# EAGLE design SNES-logo-leds (EAGLE 7.2.0)
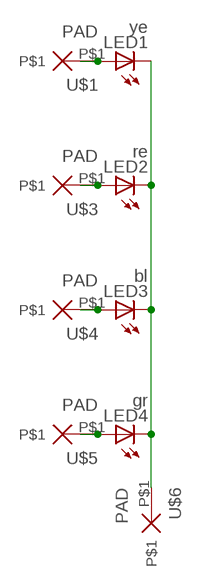
[diagram p0: schematic, sheet 1]

## Parts
LED1  ye  LEDSML0805  [SML0805]
LED2  re  LEDSML0805  [SML0805]
LED3  bl  LEDSML0805  [SML0805]
LED4  gr  LEDSML0805  [SML0805]
U$1  PAD  [PAD]
U$3  PAD  [PAD]
U$4  PAD  [PAD]
U$5  PAD  [PAD]
U$6  PAD  [PAD]

## Nets
N$1: LED1.C LED2.C LED3.C LED4.C U$6.P$1
N$3: LED1.A U$1.P$1
N$20: LED2.A U$3.P$1
N$21: LED3.A U$4.P$1
N$22: LED4.A U$5.P$1

## Library data of the parts
LED1-LED4 = led:LED: LED OSRAM: - CHIPLED LG R971, LG N971, LY N971, LG Q971, LY Q971, LO R971, LY R971 LH N974, LH R974 LS Q976, LO Q976, LY Q976 LO Q996 - Hyper CHIPLED LW Q18S LB Q993, LB Q99A, LB R99A - SideLED LS A670, LO A670, LY A670, LG A670, LP A670 LB A673, LV A673, LT A673, LW A673 LH A674 LY A675 LS A676, LA A676, LO A676, LY A676, LW A676 LS A679, LY A679, LG A679 - Hyper Micro SIDELED® LS Y876, LA Y876, LO Y876, LY Y876 LT Y87S - SmartLED LW L88C, LW L88S LB L89C, LB L89S, LG L890 LS L89K, LO L89K, LY L89K LS L896, LA L896, LO L896, LY L896 - TOPLED LS T670, LO T670, LY T670, LG T670, LP T670 LSG T670, LSP T670, LSY T670, LOP T670, LYG T670 LG T671, LOG T671, LSG T671 LB T673, LV T673, LT T673, LW T673 LH T674 LS T676, LA T676, LO T676, LY T676, LB T676, LH T676, LSB T676, LW T676 LB T67C, LV T67C, LT T67C, LS T67K, LO T67K, LY T67K, LW E67C LS E67B, LA E67B, LO E67B, LY E67B, LB E67C, LV E67C, LT E67C LW T67C LS T679, LY T679, LG T679 LS T770, LO T770, LY T770, LG T770, LP T770 LB T773, LV T773, LT T773, LW T773 LH T774 LS E675, LA E675, LY E675, LS T675 LS T776, LA T776, LO T776, LY T776, LB T776 LHGB T686 LT T68C, LB T68C - Hyper Mini TOPLED® LB M676 - Mini TOPLED Santana® LG M470 LS M47K, LO M47K, LY M47K Source: http://www.osram.convergy.de LUXEON: - LUMILED® LXK2-PW12-R00, LXK2-PW12-S00, LXK2-PW14-U00, LXK2-PW14-V00 LXK2-PM12-R00, LXK2-PM12-S00, LXK2-PM14-U00 LXK2-PE12-Q00, LXK2-PE12-R00, LXK2-PE12-S00, LXK2-PE14-T00, LXK2-PE14-U00 LXK2-PB12-K00, LXK2-PB12-L00, LXK2-PB12-M00, LXK2-PB14-N00, LXK2-PB14-P00, LXK2-PB14-Q00 LXK2-PR12-L00, LXK2-PR12-M00, LXK2-PR14-Q00, LXK2-PR14-R00 LXK2-PD12-Q00, LXK2-PD12-R00, LXK2-PD12-S00 LXK2-PH12-R00, LXK2-PH12-S00 LXK2-PL12-P00, LXK2-PL12-Q00, LXK2-PL12-R00 Source: www.luxeon.com KINGBRIGHT: KA-3528ASYC Source: www.kingbright.com
U$1 U$3-U$6 = MS_Mod:PAD

## Board
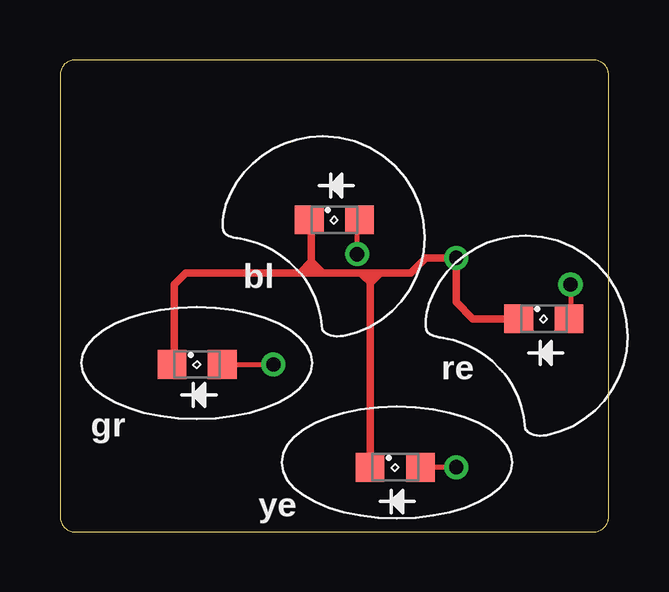
[diagram p1: board, top side]
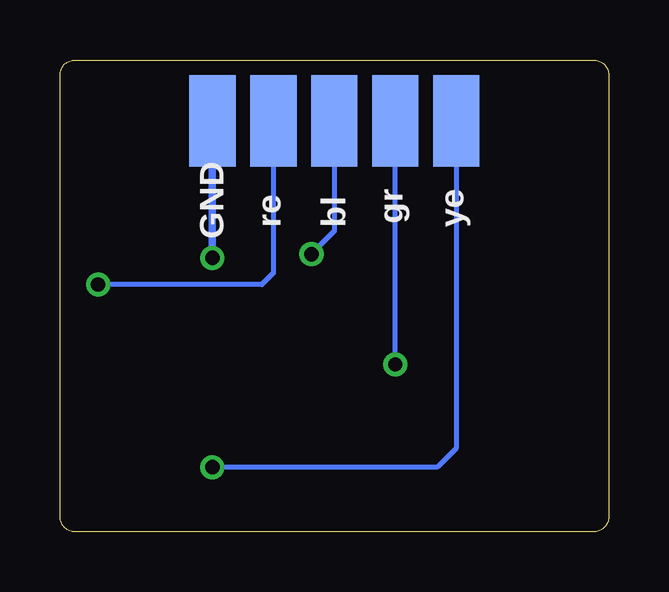
[diagram p2: board, bottom side, seen from below]

Size 22.86 x 19.68 mm. Coordinates in mm from the lower left corner, seen from the top.
Outline: 0.64,19.68 arc90 0,19.05 0,0.64 arc90 0.64,0 22.23,0 arc90 22.86,0.64 22.86,19.05 arc90 22.23,19.68 0.64,19.68
Copper layers (1*16): Top 0.035mm / dielectric 1.5mm / Bottom 0.035mm
Design rules "default": minimum track width 10mil, minimum drill 0.6mm, track to track 8mil, track to pad 8mil, pad to pad 8mil, via to via 8mil, smd to smd 8mil, copper to edge 40mil, drill to drill 8mil, minimum pad ring 10mil, minimum via ring 8mil, stop-mask expansion 4mil, vias tented up to drill 0mil, thermal gap 10mil

### Footprints (pad centres in the part's own frame; a part is rotated, then mirrored left to right if it is on the bottom)
SML0805 = smd 1.2 x 1.2: A 1.05,0; C -1.05,0
PAD = smd 1.93 x 3.81: P$1 0,0

### Placement (x,y rotation side)
LED1  13.97,2.7 0 top
LED2  20.16,8.89 0 top
LED3  11.43,13.02 0 top
LED4  5.71,6.99 0 top
U$1  6.35,17.14 0 bottom
U$3  13.97,17.14 0 bottom
U$4  11.43,17.14 0 bottom
U$5  8.89,17.14 0 bottom
U$6  16.51,17.14 0 bottom

### Tracks (layer width: path | path; a pad name or v marks a point on that pad's centre or on a via)
N$1  (via drill 0.6)
  Top 0.203: 10.48,12.92 LED3.C | LED4.C 4.76,6.99 | 10.79,10.95 10.79,10.79 10.48,11.11 10.32,10.95 10.48,10.95 | 12.86,10.48 13.02,10.64
  Top 0.305: 10,10.79 10.79,10.79 10.95,10.79 | 10.48,11.27 10.48,12.92 | 10,10.79 10.48,11.27 | 4.76,6.99 4.76,10.32 5.24,10.79 10,10.79 | 10.48,11.27 10.79,10.95 10.95,10.79 | LED1.C 12.92,10.38 13.34,10.79 | 13.34,10.79 12.54,10.79 | 12.7,10.64 12.86,10.48 | 13.02,10.64 12.7,10.64 | 12.7,10.64 12.54,10.79 | 12.54,10.79 10.95,10.79 | 13.34,10.79 14.61,10.79 15.24,11.43 v16.51,11.43 16.51,9.59 17.21,8.89 LED2.C
  Bottom 0.305: U$6.P$1 v16.51,11.43
N$3  (via drill 0.6)
  Top 0.203: v16.51,2.7 LED1.A
  Bottom 0.203: U$1.P$1 6.35,3.49 7.14,2.7 v16.51,2.7
N$20  (via drill 0.6)
  Top 0.203: v21.27,10.32 21.27,8.95 LED2.A
  Bottom 0.203: U$3.P$1 13.97,10.79 14.45,10.32 v21.27,10.32
N$21  (via drill 0.6)
  Top 0.203: v12.38,11.59 12.38,12.92 LED3.A
  Bottom 0.203: U$4.P$1 11.43,12.54 v12.38,11.59
N$22  (via drill 0.6)
  Top 0.203: LED4.A v8.89,6.99
  Bottom 0.203: v8.89,6.99 U$5.P$1

### Text on the board
tNames: bl | re | gr | ye
bNames: ye | gr | bl | re | GND